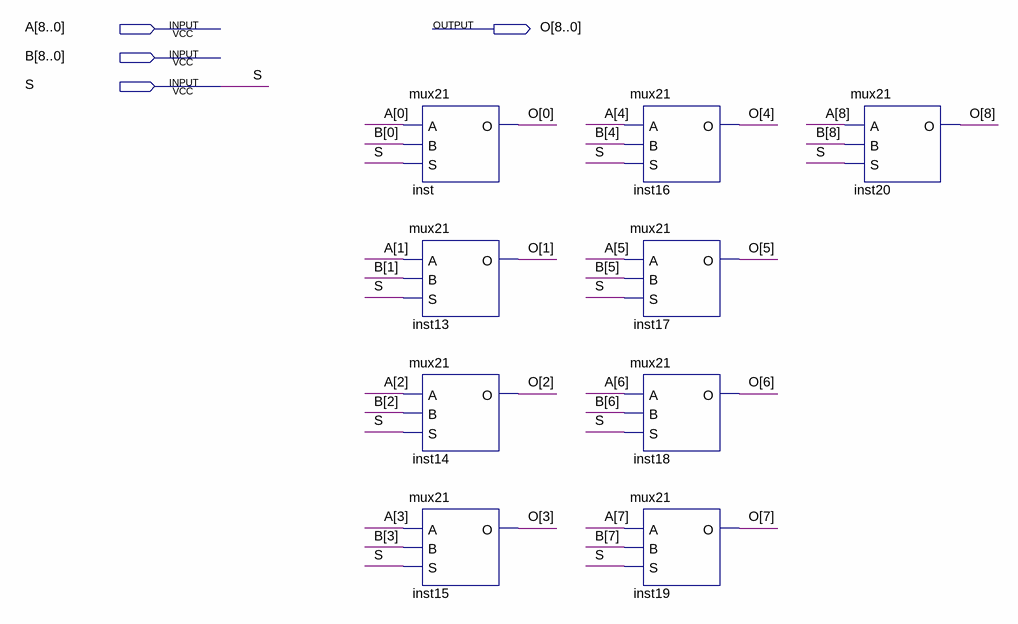
[diagram p0: schematic sheet]
// Quartus schematic mux21_9bit.bdf as structural Verilog: 9 symbols, 4 pins
module mux21_9bit (
  input  [8:0] A,
  input  [8:0] B,
  input  S,
  output [8:0] O
);

  mux21 inst (.A(A[0]), .B(B[0]), .S(S), .O(O[0]));
  mux21 inst13 (.A(A[1]), .B(B[1]), .S(S), .O(O[1]));
  mux21 inst14 (.A(A[2]), .B(B[2]), .S(S), .O(O[2]));
  mux21 inst15 (.A(A[3]), .B(B[3]), .S(S), .O(O[3]));
  mux21 inst16 (.A(A[4]), .B(B[4]), .S(S), .O(O[4]));
  mux21 inst17 (.A(A[5]), .B(B[5]), .S(S), .O(O[5]));
  mux21 inst18 (.A(A[6]), .B(B[6]), .S(S), .O(O[6]));
  mux21 inst19 (.A(A[7]), .B(B[7]), .S(S), .O(O[7]));
  mux21 inst20 (.A(A[8]), .B(B[8]), .S(S), .O(O[8]));
endmodule
